# EAGLE schematic DM01x2 (EAGLE 6.6.0)

## Sheet 1 of 6
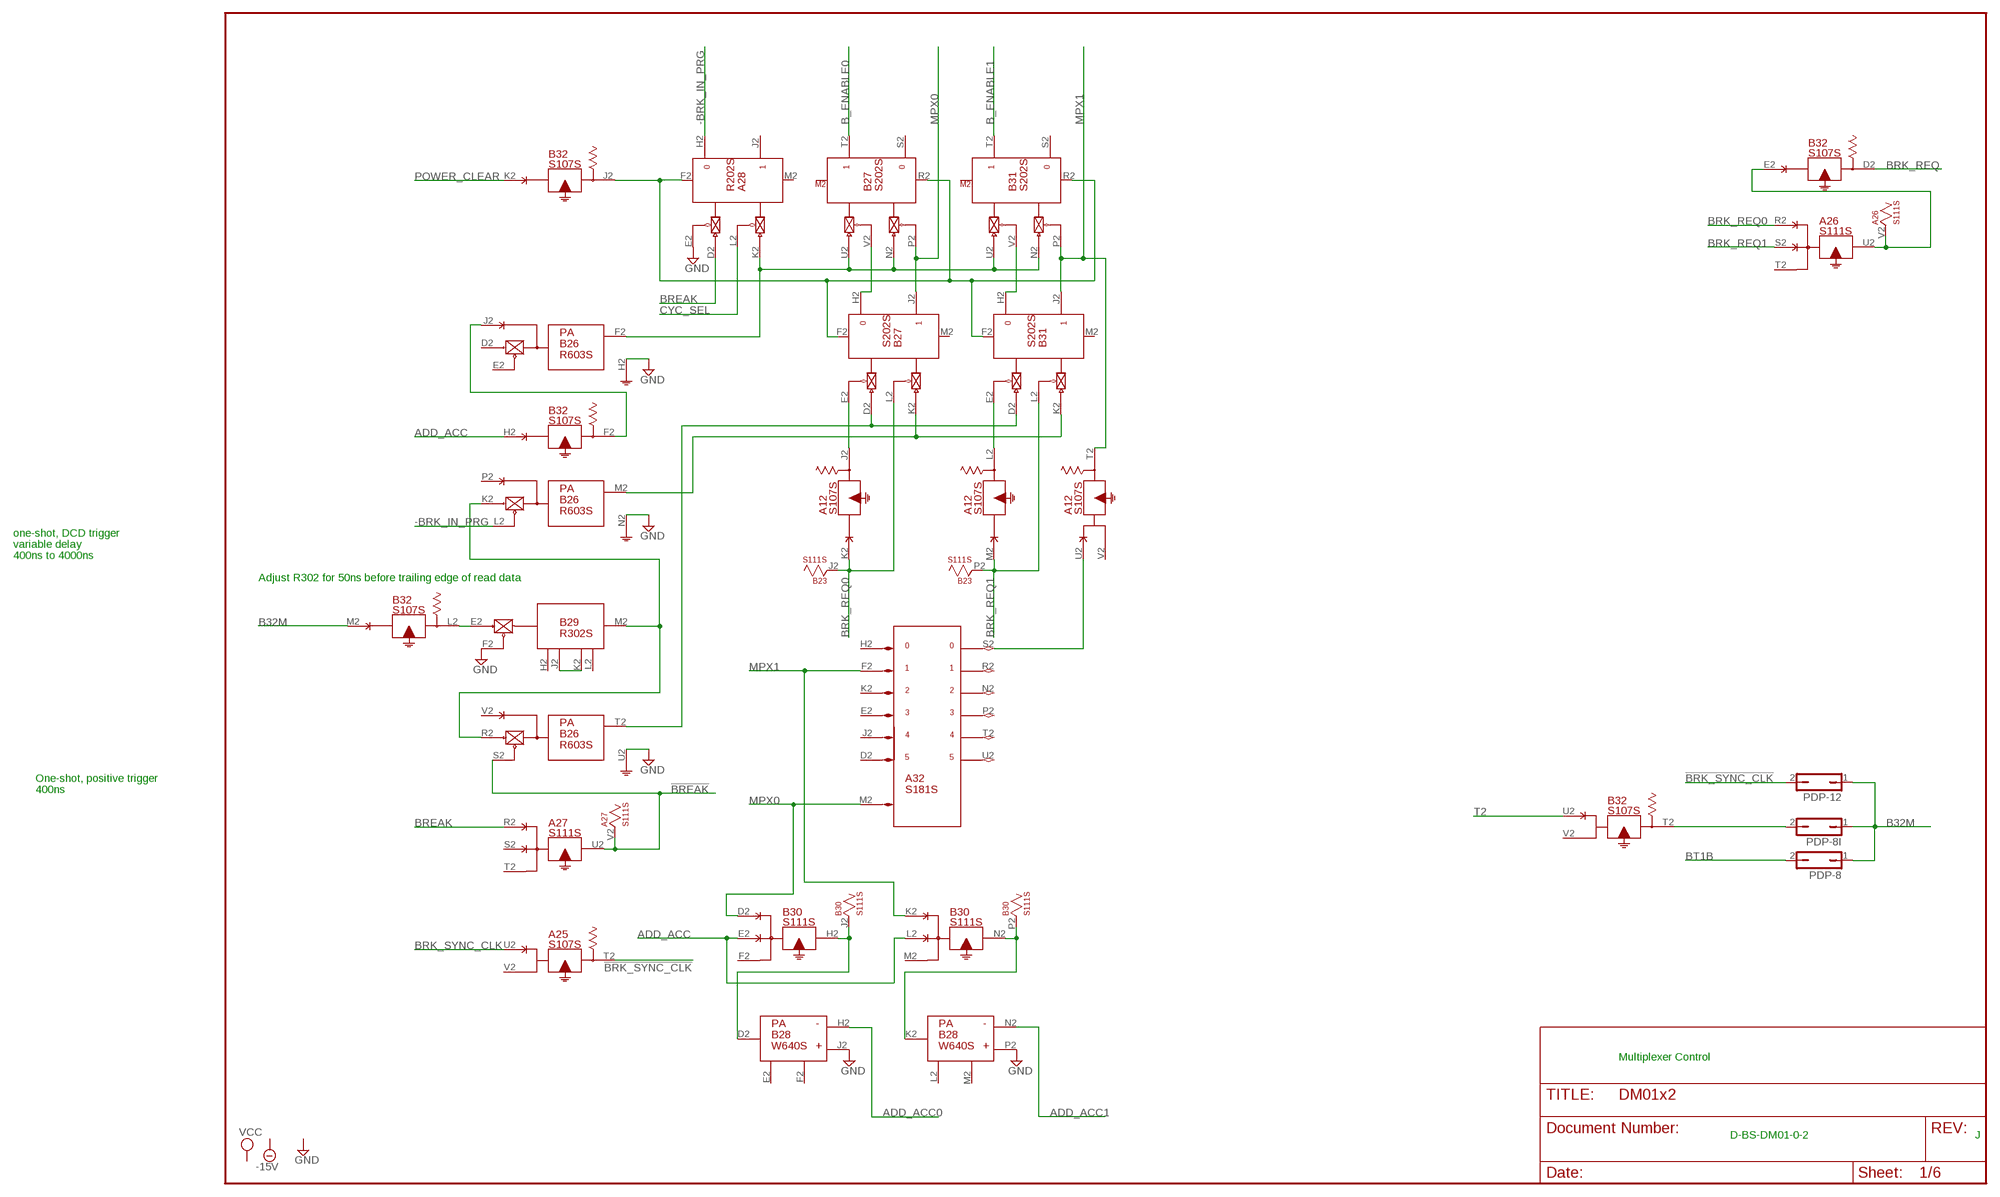
[diagram p0: schematic, sheet 1]

### Parts
A12  S107S  R107S  [H807S]
A25  S107S  R107S  [H807S]
A26  S111S  R111S  [H807S]
A27  S111S  R111S  [H807S]
A28  R202S  [H807S]
A32  S181S  R181S  [H807S]
B23  S111S  R111S  [H807S]
B26  R603S  [H807S]
B27  S202S  R202S  [H807S]
B28  W640S  [H807S]
B29  R302S  [H807S]
B30  S111S  R111S  [H807S]
B31  S202S  R202S  [H807S]
B32  S107S  R107S  [H807S]
PDP-8  JP1Q  [JP1]
PDP-8I  JP1Q  [JP1]
PDP-12  JP1Q  [JP1]

### Nets
!BREAK: A27.U2(U:O$1) A27.V2 B26.S2(T:EN0)
!BRK_SYNC_CLK: A25.T2(T:O$1) PDP-12.2
-BRK_IN_PRG: A28.H2 B26.L2(M:EN0)
ADD_ACC: B30.E2(H:I$2) B30.L2(N:I$2) B32.H2(F:I$1) ; also sheet 2
ADD_ACC0: B28.H2(H) ; also sheet 2
ADD_ACC1: B28.N2(H) ; also sheet 2
B32M: B32.M2(L:I$1) PDP-8.1 PDP-8I.1 PDP-12.1
B_ENABLE0: B27.T2 ; also sheet 2,4
B_ENABLE1: B31.T2 ; also sheet 2,4
BREAK: A27.R2(U:I$1) A28.D2(J:PU0) ; also sheet 2,4
BRK_REQ: B32.D2(D:O$1) ; also sheet 2
BRK_REQ0: A12.K2(J:I$1) A26.R2(U:I$1) B23.J2 B27.L2(J:EN1) ; also sheet 2
BRK_REQ1: A12.M2(L:I$1) A26.S2(U:I$2) B23.P2 B31.L2(J:EN1) ; also sheet 2
BRK_SYNC_CLK: A25.U2(T:I$1) ; also sheet 3
BT1B: PDP-8.2 ; also sheet 3
CYC_SEL: A28.L2(J:EN1) ; also sheet 2,5
GND [Supply]: A28.E2(J:EN0) B26.H2(F:G) B26.N2(M:G) B26.U2(T:G) B28.J2(J) B28.P2(J) B29.F2(M:F) ; also sheet 4
MPX0: A32.M2(M) B27.J2 B27.P2(T:EN0) B30.D2(H:I$1) ; also sheet 2,4
MPX1: A12.T2(T:O$1) A32.F2(F) B30.K2(N:I$1) B31.J2 B31.P2(T:EN0) ; also sheet 2,4
N$2: A28.F2(J:RESET) B27.F2(J:RESET) B27.R2(T:RESET) B31.F2(J:RESET) B31.R2(T:RESET) B32.J2(J:O$1)
N$3: B26.J2(F:I$1) B32.F2(F:O$1)
N$4: B32.T2(T:O$1) PDP-8I.2
N$5: B26.K2(M:PU0) B26.R2(T:PU0) B29.M2(M:M)
N$7: B27.H2 B27.V2(T:EN1)
N$9: B31.H2 B31.V2(T:EN1)
N$10: B26.M2(M:O) B27.K2(J:PU1) B31.K2(J:PU1)
N$12: A28.K2(J:PU1) B26.F2(F:O) B27.N2(T:PU0) B27.U2(T:PU1) B31.N2(T:PU0) B31.U2(T:PU1)
N$21: A26.U2(U:O$1) A26.V2 B32.E2(D:I$1)
N$23: A12.J2(J:O$1) B27.E2(J:EN0)
N$24: A12.L2(L:O$1) B31.E2(J:EN0)
N$30: B28.D2(D) B30.H2(H:O$1) B30.J2
N$32: B26.T2(T:O) B27.D2(J:PU0) B31.D2(J:PU0)
N$36: B28.K2(D) B30.N2(N:O$1) B30.P2
N$38: A12.U2(T:I$1) A32.S2(S)
N$46: B29.E2(M:E) B32.L2(L:O$1)
N$47: B29.J2(M:J) B29.K2(M:K)
POWER_CLEAR: B32.K2(J:I$1) ; also sheet 3
T2: B32.U2(T:I$1) ; also sheet 3
Unconnected: A12.V2(T:I$2) A25.V2(T:I$2) A26.T2(U:I$3) A27.S2(U:I$2) A27.T2(U:I$3) A28.J2 A28.M2(J:SET) A28.N2(T:PU0) A28.P2(T:EN0) A28.R2(T:RESET) A28.S2 A28.T2 A28.U2(T:PU1) A28.V2(T:EN1) A32.D2(D) A32.E2(E) A32.H2(H) A32.J2(J) A32.K2(K) A32.L2(I$1) A32.N2(N) A32.P2(P) A32.R2(R) A32.T2(T) A32.U2(U) A32.V2(O$1) B23.V2 B26.D2(F:PU0) B26.E2(F:EN0) B26.P2(M:I$1) B26.V2(T:I$1) B27.M2(J:SET) B27.S2 B28.E2(E) B28.F2(F) B28.L2(E) B28.M2(F) B29.H2(M:H) B29.L2(M:L) B30.F2(H:I$3) B30.M2(N:I$3) B30.R2(U:I$1) B30.S2(U:I$2) B30.T2(U:I$3) B30.U2(U:O$1) B30.V2 B31.M2(J:SET) B31.S2 B32.V2(T:I$2)

### Notes on the sheet
- one-shot, DCD trigger
- variable delay
- 400ns to 4000ns
- Adjust R302 for 50ns before trailing edge of read data
- One-shot, positive trigger
- 400ns
- Multiplexer Control
- D-BS-DM01-0-2 | J

## Sheet 2 of 6
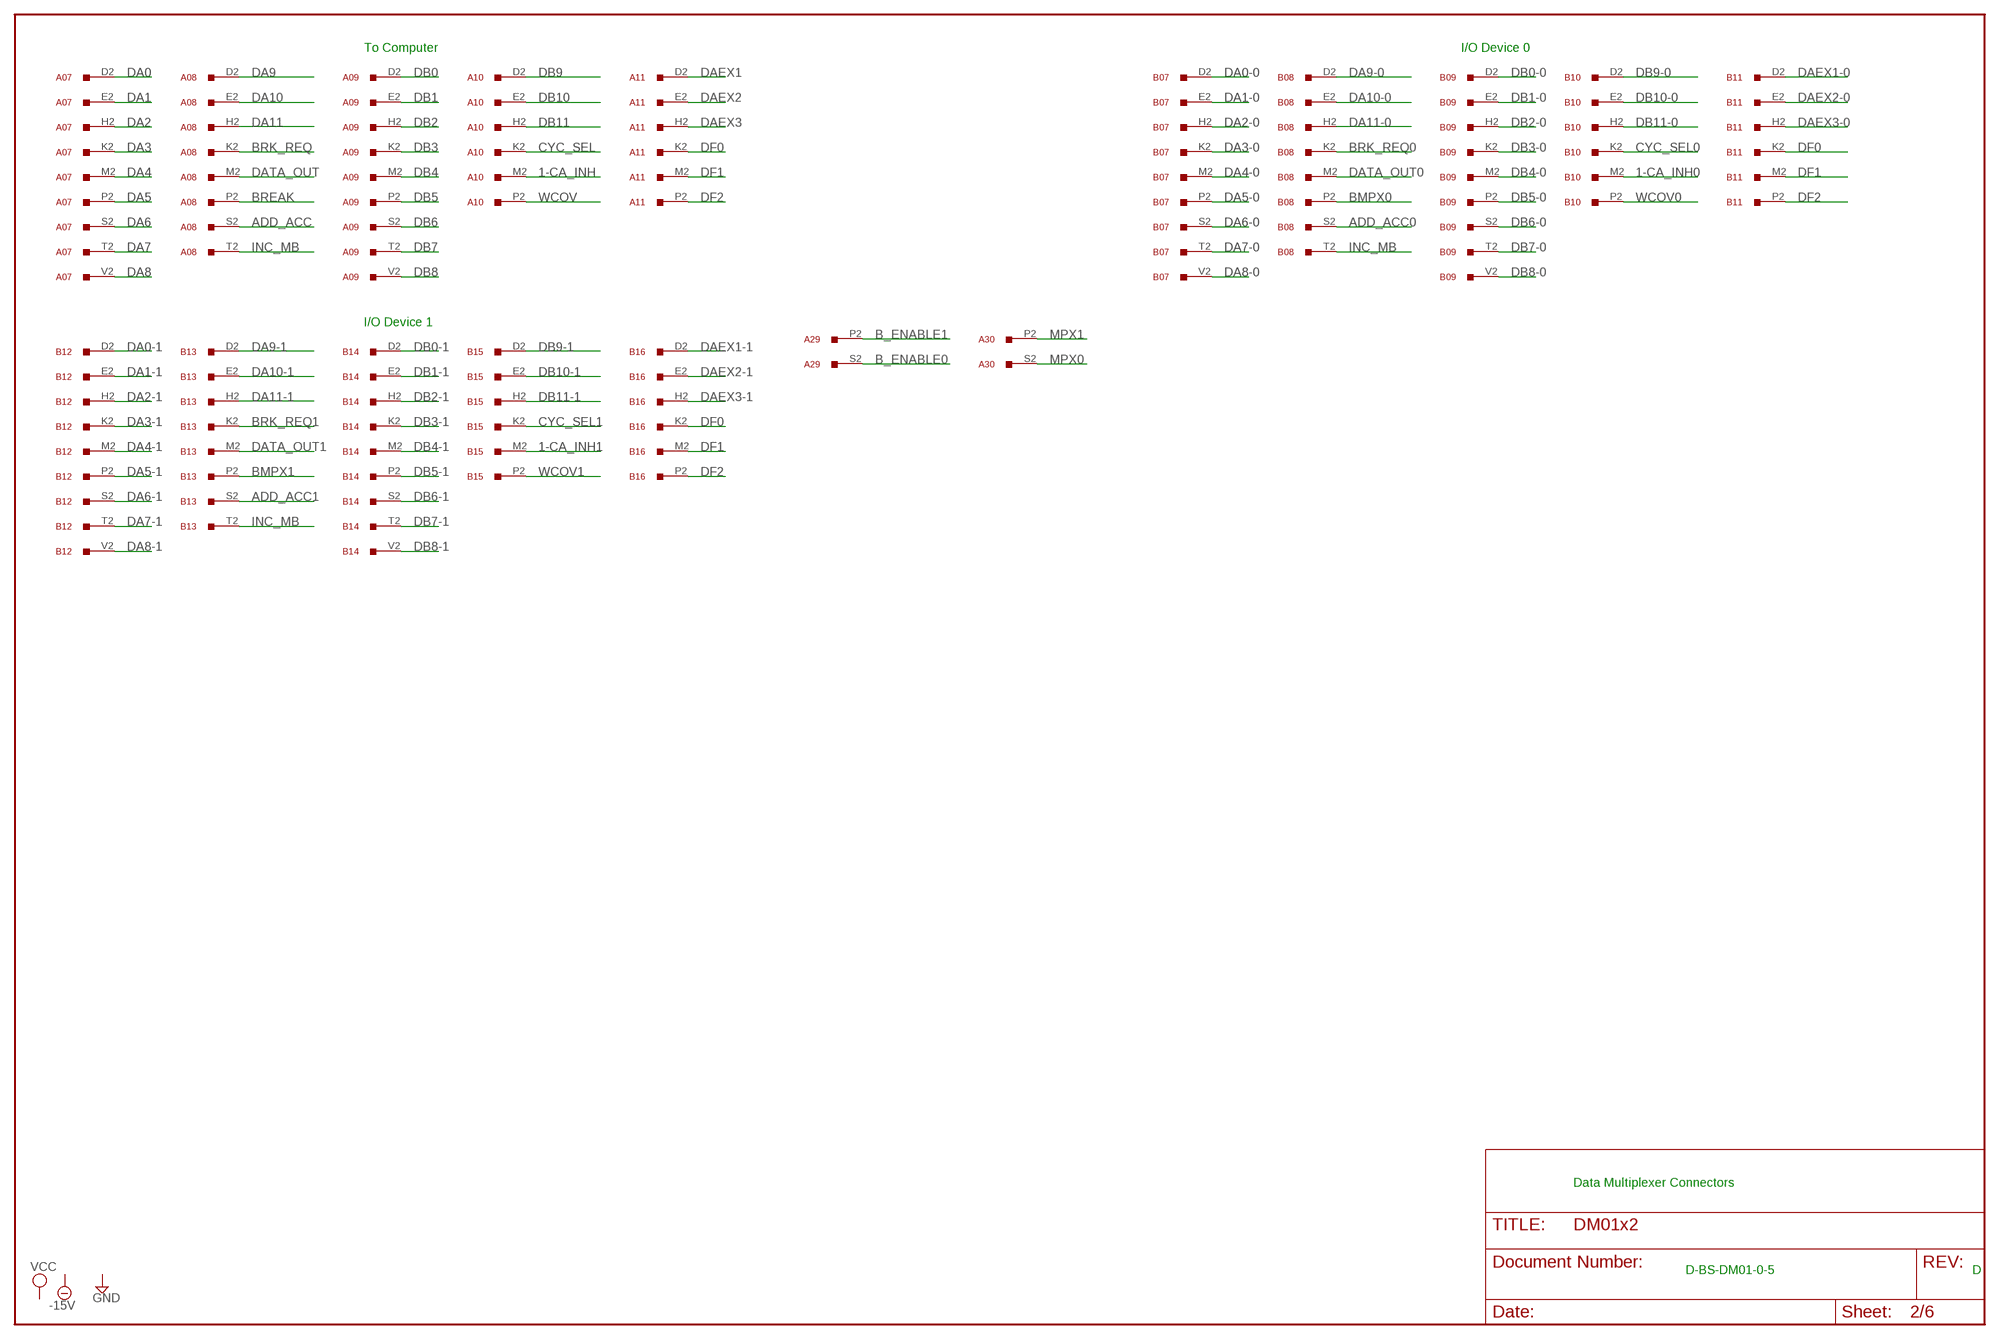
[diagram p1: schematic, sheet 2]

### Parts
A07  W021S  [H807S]
A08  W021S  [H807S]
A09  W021S  [H807S]
A10  W021S  [H807S]
A11  W021S  [H807S]
A29  W021S  [H807S]
A30  W021S  [H807S]
B07  W021S  [H807S]
B08  W021S  [H807S]
B09  W021S  [H807S]
B10  W021S  [H807S]
B11  W021S  [H807S]
B12  W021S  [H807S]
B13  W021S  [H807S]
B14  W021S  [H807S]
B15  W021S  [H807S]
B16  W021S  [H807S]

### Nets
1-CA_INH: A10.M2 ; also sheet 6
1-CA_INH0: B10.M2 ; also sheet 6
1-CA_INH1: B15.M2 ; also sheet 6
ADD_ACC: A08.S2 ; also sheet 1
ADD_ACC0: B08.S2 ; also sheet 1
ADD_ACC1: B13.S2 ; also sheet 1
B_ENABLE0: A29.S2 ; also sheet 1,4
B_ENABLE1: A29.P2 ; also sheet 1,4
BMPX0: B08.P2 ; also sheet 4
BMPX1: B13.P2 ; also sheet 4
BREAK: A08.P2 ; also sheet 1,4
BRK_REQ: A08.K2 ; also sheet 1
BRK_REQ0: B08.K2 ; also sheet 1
BRK_REQ1: B13.K2 ; also sheet 1
CYC_SEL: A10.K2 ; also sheet 1,5
CYC_SEL0: B10.K2 ; also sheet 5
CYC_SEL1: B15.K2 ; also sheet 5
DA0: A07.D2 ; also sheet 5
DA0-0: B07.D2 ; also sheet 5
DA0-1: B12.D2 ; also sheet 5
DA1: A07.E2 ; also sheet 5
DA1-0: B07.E2 ; also sheet 5
DA1-1: B12.E2 ; also sheet 5
DA2: A07.H2 ; also sheet 5
DA2-0: B07.H2 ; also sheet 5
DA2-1: B12.H2 ; also sheet 5
DA3: A07.K2 ; also sheet 5
DA3-0: B07.K2 ; also sheet 5
DA3-1: B12.K2 ; also sheet 5
DA4: A07.M2 ; also sheet 5
DA4-0: B07.M2 ; also sheet 5
DA4-1: B12.M2 ; also sheet 5
DA5: A07.P2 ; also sheet 5
DA5-0: B07.P2 ; also sheet 5
DA5-1: B12.P2 ; also sheet 5
DA6: A07.S2 ; also sheet 5
DA6-0: B07.S2 ; also sheet 5
DA6-1: B12.S2 ; also sheet 5
DA7: A07.T2 ; also sheet 5
DA7-0: B07.T2 ; also sheet 5
DA7-1: B12.T2 ; also sheet 5
DA8: A07.V2 ; also sheet 5
DA8-0: B07.V2 ; also sheet 5
DA8-1: B12.V2 ; also sheet 5
DA9: A08.D2 ; also sheet 5
DA9-0: B08.D2 ; also sheet 5
DA9-1: B13.D2 ; also sheet 5
DA10: A08.E2 ; also sheet 5
DA10-0: B08.E2 ; also sheet 5
DA10-1: B13.E2 ; also sheet 5
DA11: A08.H2 ; also sheet 5
DA11-0: B08.H2 ; also sheet 5
DA11-1: B13.H2 ; also sheet 5
DAEX1: A11.D2 ; also sheet 5
DAEX1-0: B11.D2 ; also sheet 5
DAEX1-1: B16.D2 ; also sheet 5
DAEX2: A11.E2 ; also sheet 5
DAEX2-0: B11.E2 ; also sheet 5
DAEX2-1: B16.E2 ; also sheet 5
DAEX3: A11.H2 ; also sheet 5
DAEX3-0: B11.H2 ; also sheet 5
DAEX3-1: B16.H2 ; also sheet 5
DATA_OUT: A08.M2 ; also sheet 6
DATA_OUT0: B08.M2 ; also sheet 6
DATA_OUT1: B13.M2 ; also sheet 6
DB0: A09.D2 ; also sheet 6
DB0-0: B09.D2 ; also sheet 6
DB0-1: B14.D2 ; also sheet 6
DB1: A09.E2 ; also sheet 6
DB1-0: B09.E2 ; also sheet 6
DB1-1: B14.E2 ; also sheet 6
DB2: A09.H2 ; also sheet 6
DB2-0: B09.H2 ; also sheet 6
DB2-1: B14.H2 ; also sheet 6
DB3: A09.K2 ; also sheet 6
DB3-0: B09.K2 ; also sheet 6
DB3-1: B14.K2 ; also sheet 6
DB4: A09.M2 ; also sheet 6
DB4-0: B09.M2 ; also sheet 6
DB4-1: B14.M2 ; also sheet 6
DB5: A09.P2 ; also sheet 6
DB5-0: B09.P2 ; also sheet 6
DB5-1: B14.P2 ; also sheet 6
DB6: A09.S2 ; also sheet 6
DB6-0: B09.S2 ; also sheet 6
DB6-1: B14.S2 ; also sheet 6
DB7: A09.T2 ; also sheet 6
DB7-0: B09.T2 ; also sheet 6
DB7-1: B14.T2 ; also sheet 6
DB8: A09.V2 ; also sheet 6
DB8-0: B09.V2 ; also sheet 6
DB8-1: B14.V2 ; also sheet 6
DB9: A10.D2 ; also sheet 6
DB9-0: B10.D2 ; also sheet 6
DB9-1: B15.D2 ; also sheet 6
DB10: A10.E2 ; also sheet 6
DB10-0: B10.E2 ; also sheet 6
DB10-1: B15.E2 ; also sheet 6
DB11: A10.H2 ; also sheet 6
DB11-0: B10.H2 ; also sheet 6
DB11-1: B15.H2 ; also sheet 6
DF0: A11.K2 B11.K2 B16.K2
DF1: A11.M2 B11.M2 B16.M2
DF2: A11.P2 B11.P2 B16.P2
INC_MB: A08.T2 B08.T2 B13.T2
MPX0: A30.S2 ; also sheet 1,4
MPX1: A30.P2 ; also sheet 1,4
WCOV: A10.P2 ; also sheet 4
WCOV0: B10.P2 ; also sheet 4
WCOV1: B15.P2 ; also sheet 4
Unconnected: A08.V2 A10.S2 A10.T2 A10.V2 A11.S2 A11.T2 A11.V2 A29.D2 A29.E2 A29.H2 A29.K2 A29.M2 A29.T2 A29.V2 A30.D2 A30.E2 A30.H2 A30.K2 A30.M2 A30.T2 A30.V2 B08.V2 B10.S2 B10.T2 B10.V2 B11.S2 B11.T2 B11.V2 B13.V2 B15.S2 B15.T2 B15.V2 B16.S2 B16.T2 B16.V2

### Notes on the sheet
- To Computer | I/O Device 0
- I/O Device 1
- Data Multiplexer Connectors
- D-BS-DM01-0-5 | D

## Sheet 3 of 6
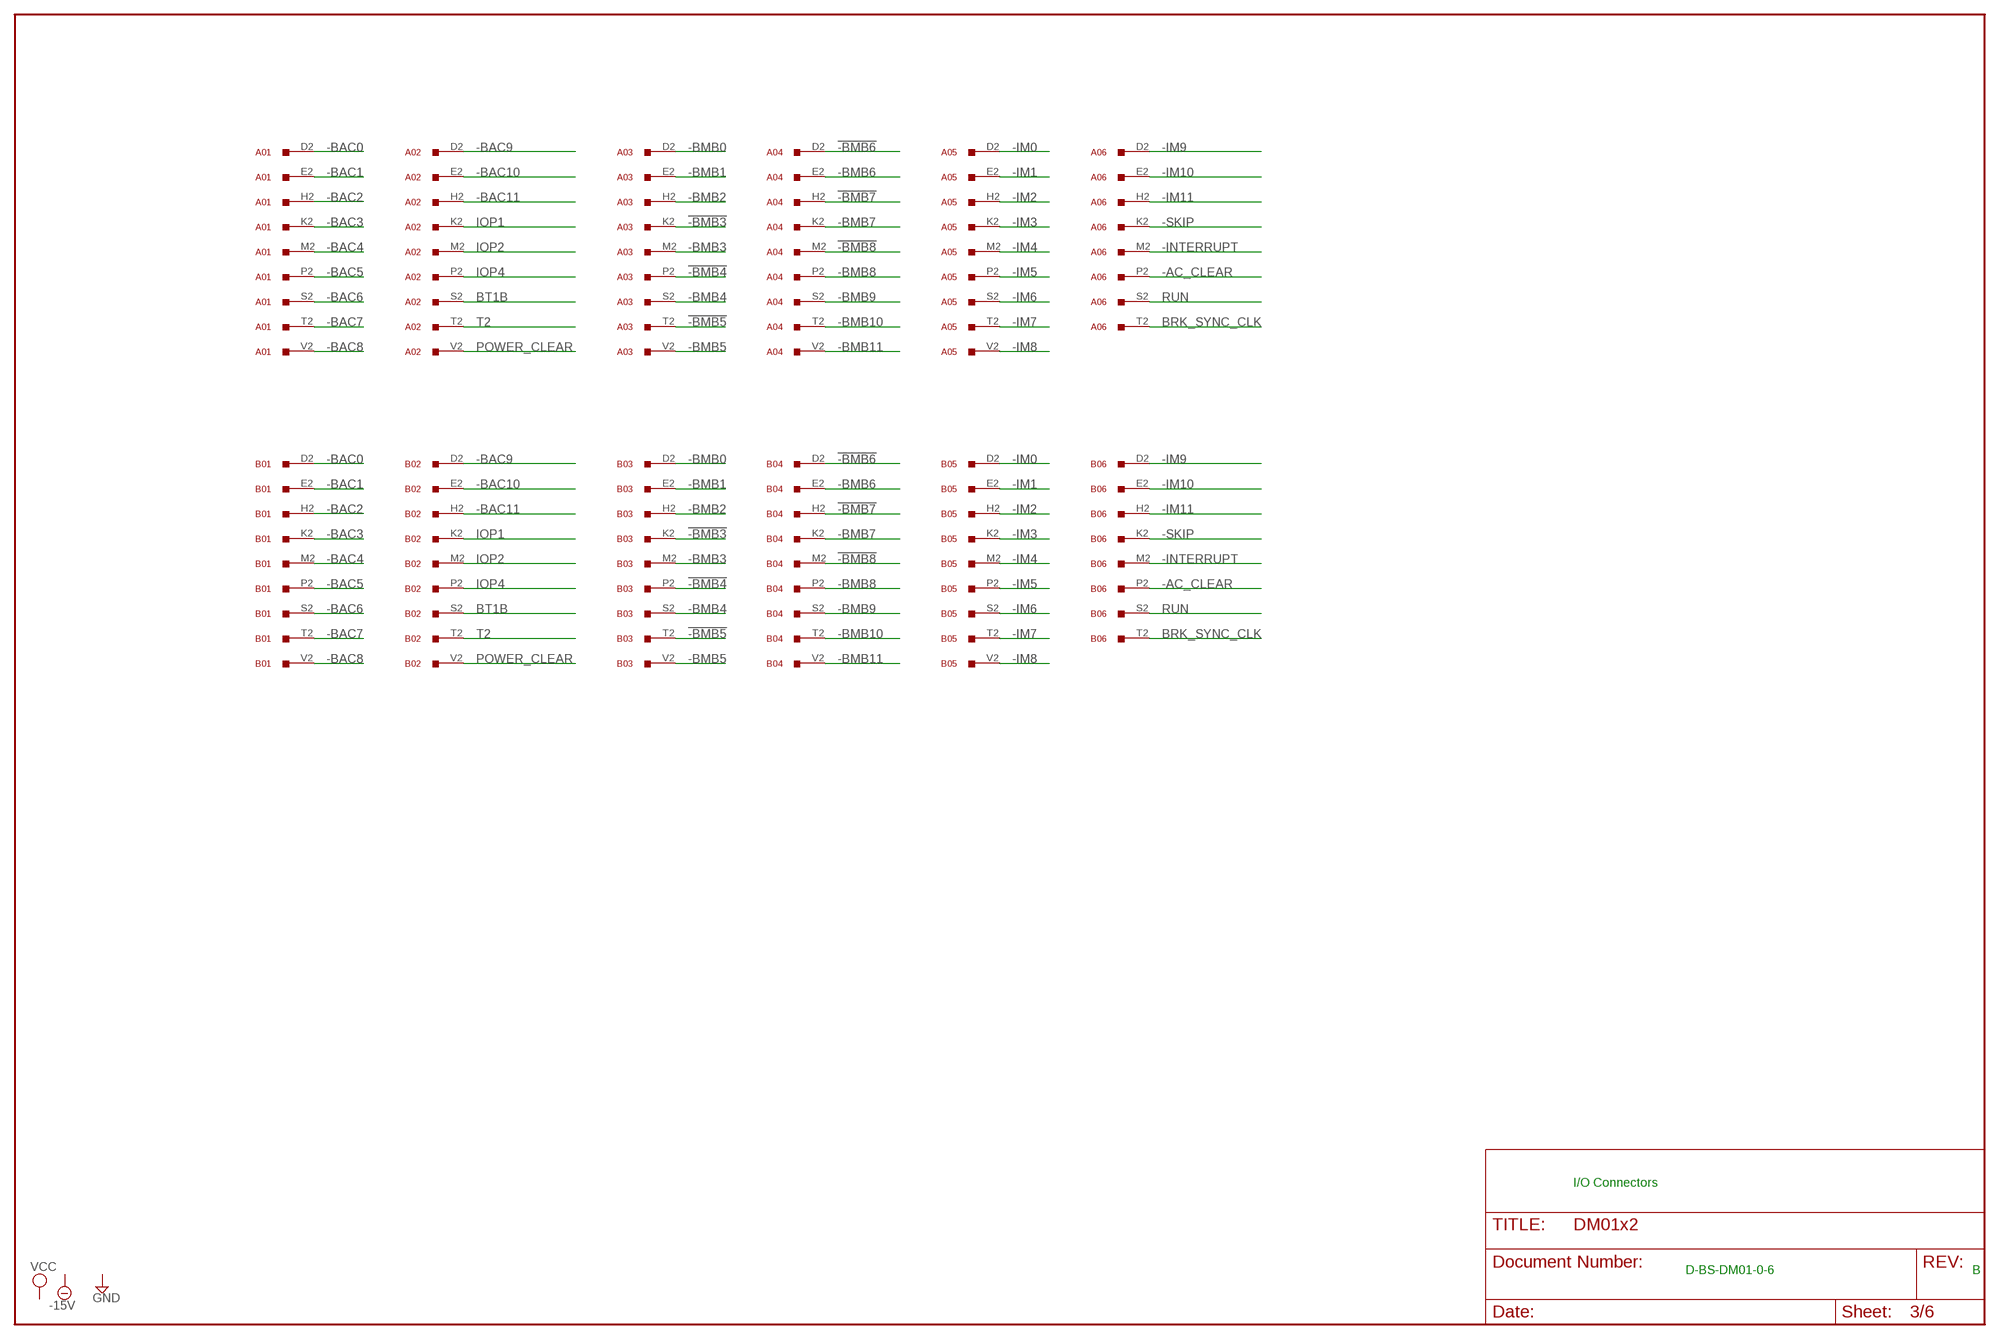
[diagram p2: schematic, sheet 3]

### Parts
A01  W021S  [H807S]
A02  W021S  [H807S]
A03  W021S  [H807S]
A04  W021S  [H807S]
A05  W021S  [H807S]
A06  W021S  [H807S]
B01  W021S  [H807S]
B02  W021S  [H807S]
B03  W021S  [H807S]
B04  W021S  [H807S]
B05  W021S  [H807S]
B06  W021S  [H807S]

### Nets
!-BMB3: A03.K2 B03.K2
!-BMB4: A03.P2 B03.P2
!-BMB5: A03.T2 B03.T2
!-BMB6: A04.D2 B04.D2
!-BMB7: A04.H2 B04.H2
!-BMB8: A04.M2 B04.M2
-AC_CLEAR: A06.P2 B06.P2
-BAC0: A01.D2 B01.D2
-BAC1: A01.E2 B01.E2
-BAC2: A01.H2 B01.H2
-BAC3: A01.K2 B01.K2
-BAC4: A01.M2 B01.M2
-BAC5: A01.P2 B01.P2
-BAC6: A01.S2 B01.S2
-BAC7: A01.T2 B01.T2
-BAC8: A01.V2 B01.V2
-BAC9: A02.D2 B02.D2
-BAC10: A02.E2 B02.E2
-BAC11: A02.H2 B02.H2
-BMB0: A03.D2 B03.D2
-BMB1: A03.E2 B03.E2
-BMB2: A03.H2 B03.H2
-BMB3: A03.M2 B03.M2
-BMB4: A03.S2 B03.S2
-BMB5: A03.V2 B03.V2
-BMB6: A04.E2 B04.E2
-BMB7: A04.K2 B04.K2
-BMB8: A04.P2 B04.P2
-BMB9: A04.S2 B04.S2
-BMB10: A04.T2 B04.T2
-BMB11: A04.V2 B04.V2
-IM0: A05.D2 B05.D2
-IM1: A05.E2 B05.E2
-IM2: A05.H2 B05.H2
-IM3: A05.K2 B05.K2
-IM4: A05.M2 B05.M2
-IM5: A05.P2 B05.P2
-IM6: A05.S2 B05.S2
-IM7: A05.T2 B05.T2
-IM8: A05.V2 B05.V2
-IM9: A06.D2 B06.D2
-IM10: A06.E2 B06.E2
-IM11: A06.H2 B06.H2
-INTERRUPT: A06.M2 B06.M2
-SKIP: A06.K2 B06.K2
BRK_SYNC_CLK: A06.T2 B06.T2 ; also sheet 1
BT1B: A02.S2 B02.S2 ; also sheet 1
IOP1: A02.K2 B02.K2
IOP2: A02.M2 B02.M2
IOP4: A02.P2 B02.P2
POWER_CLEAR: A02.V2 B02.V2 ; also sheet 1
RUN: A06.S2 B06.S2
T2: A02.T2 B02.T2 ; also sheet 1
Unconnected: A06.V2 B06.V2

### Notes on the sheet
- I/O Connectors
- D-BS-DM01-0-6 | B

## Sheet 4 of 6
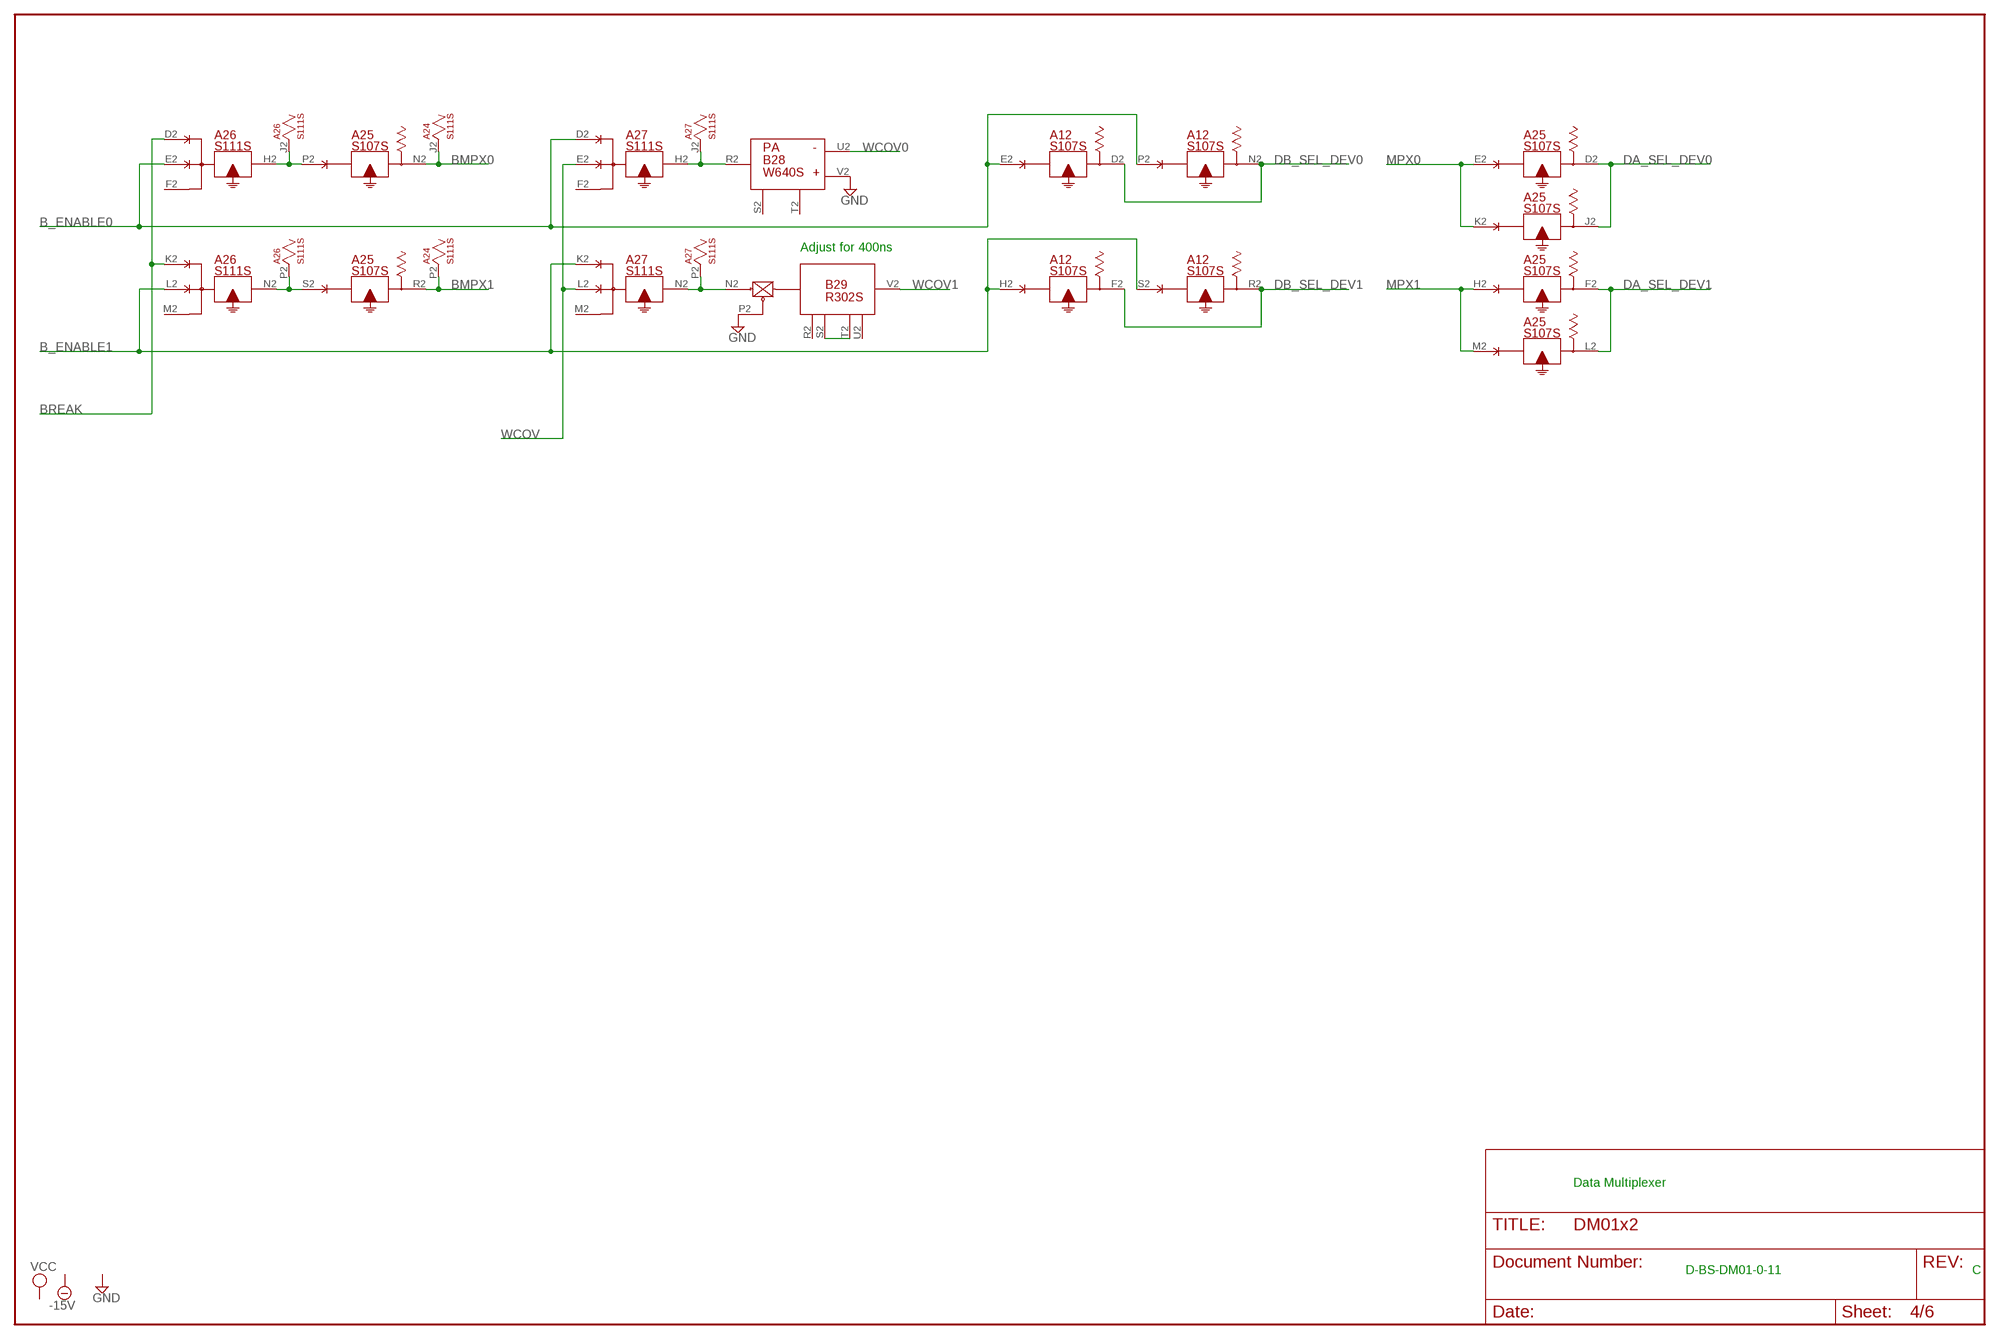
[diagram p3: schematic, sheet 4]

### Parts
A24  S111S  R111S  [H807S]

### Nets
B_ENABLE0: A12.E2(D:I$1) A12.P2(N:I$1) A26.E2(H:I$2) A27.D2(H:I$1) ; also sheet 1,2
B_ENABLE1: A12.H2(F:I$1) A12.S2(R:I$1) A26.L2(N:I$2) A27.K2(N:I$1) ; also sheet 1,2
BMPX0: A24.J2 A25.N2(N:O$1) ; also sheet 2
BMPX1: A24.P2 A25.R2(R:O$1) ; also sheet 2
BREAK: A26.D2(H:I$1) A26.K2(N:I$1) ; also sheet 1,2
DA_SEL_DEV0: A25.D2(D:O$1) A25.J2(J:O$1) ; also sheet 5
DA_SEL_DEV1: A25.F2(F:O$1) A25.L2(L:O$1) ; also sheet 5
DB_SEL_DEV0: A12.D2(D:O$1) A12.N2(N:O$1) ; also sheet 6
DB_SEL_DEV1: A12.F2(F:O$1) A12.R2(R:O$1) ; also sheet 6
GND [Supply]: B28.V2(J) B29.P2(V:F) ; also sheet 1
MPX0: A25.E2(D:I$1) A25.K2(J:I$1) ; also sheet 1,2
MPX1: A25.H2(F:I$1) A25.M2(L:I$1) ; also sheet 1,2
N$49: A27.H2(H:O$1) A27.J2 B28.R2(D)
N$50: A27.N2(N:O$1) A27.P2 B29.N2(V:E)
N$51: B29.S2(V:J) B29.T2(V:K)
N$64: A25.P2(N:I$1) A26.H2(H:O$1) A26.J2
N$65: A25.S2(R:I$1) A26.N2(N:O$1) A26.P2
WCOV: A27.E2(H:I$2) A27.L2(N:I$2) ; also sheet 2
WCOV0: B28.U2(H) ; also sheet 2
WCOV1: B29.V2(V:M) ; also sheet 2
Unconnected: A24.V2 A26.F2(H:I$3) A26.M2(N:I$3) A27.F2(H:I$3) A27.M2(N:I$3) B28.S2(E) B28.T2(F) B29.R2(V:H) B29.U2(V:L)

### Notes on the sheet
- Adjust for 400ns
- Data Multiplexer
- D-BS-DM01-0-11 | C

## Sheet 5 of 6
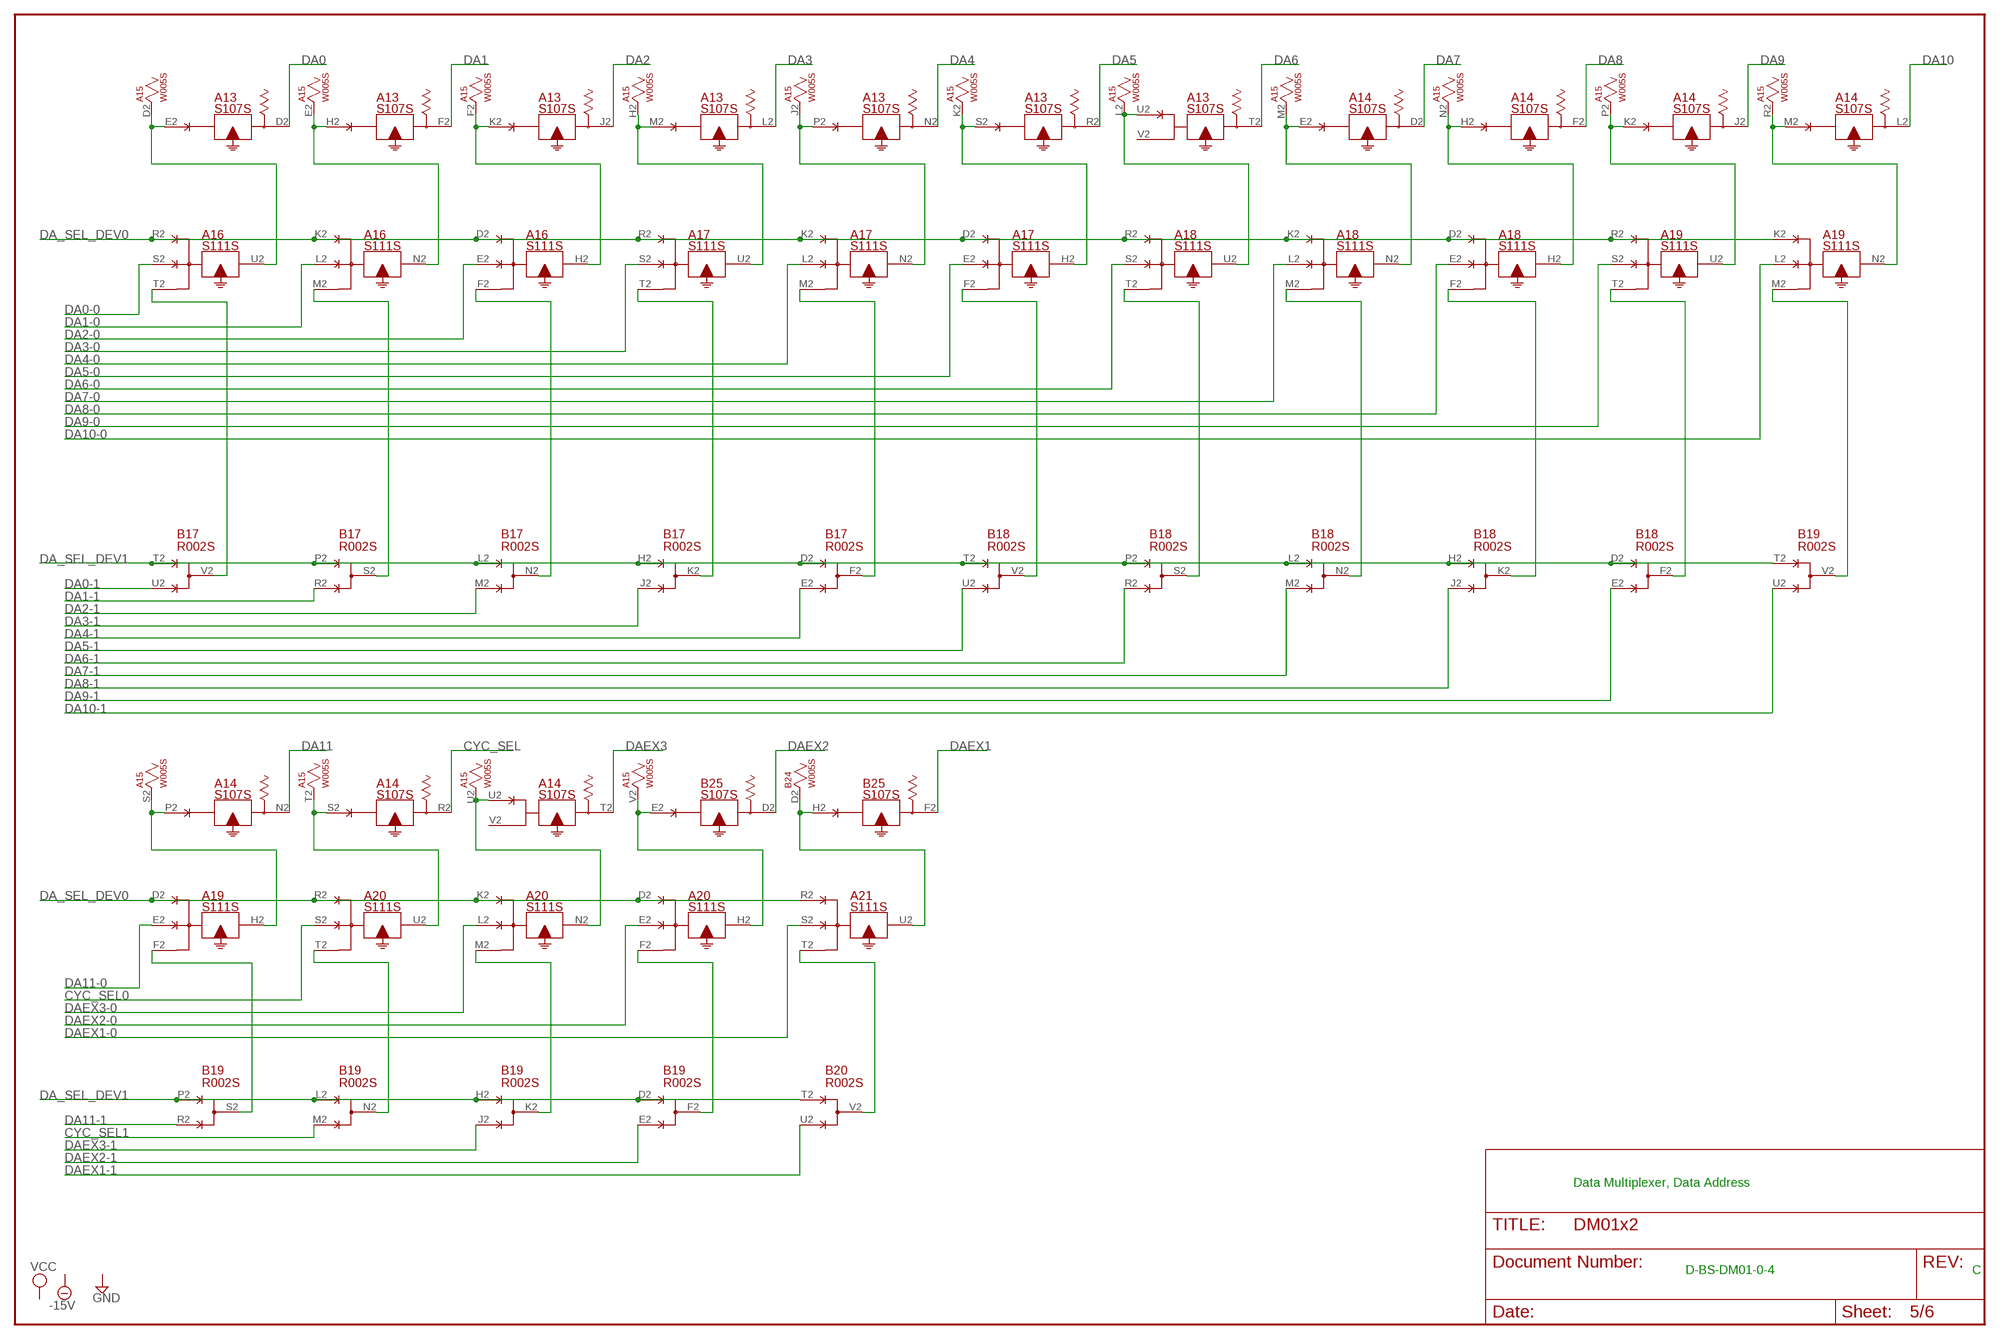
[diagram p4: schematic, sheet 5]

### Parts
A13  S107S  R107S  [H807S]
A14  S107S  R107S  [H807S]
A15  W005S  [H807S]
A16  S111S  R111S  [H807S]
A17  S111S  R111S  [H807S]
A18  S111S  R111S  [H807S]
A19  S111S  R111S  [H807S]
A20  S111S  R111S  [H807S]
A21  S111S  R111S  [H807S]
B17  R002S  [H807S]
B18  R002S  [H807S]
B19  R002S  [H807S]
B20  R002S  [H807S]
B24  W005S  [H807S]
B25  S107S  R107S  [H807S]

### Nets
CYC_SEL: A14.R2(R:O$1) ; also sheet 1,2
CYC_SEL0: A20.S2(U:I$2) ; also sheet 2
CYC_SEL1: B19.M2(N:E) ; also sheet 2
DA0: A13.D2(D:O$1) ; also sheet 2
DA0-0: A16.S2(U:I$2) ; also sheet 2
DA0-1: B17.U2(V:E) ; also sheet 2
DA1: A13.F2(F:O$1) ; also sheet 2
DA1-0: A16.L2(N:I$2) ; also sheet 2
DA1-1: B17.R2(S:E) ; also sheet 2
DA2: A13.J2(J:O$1) ; also sheet 2
DA2-0: A16.E2(H:I$2) ; also sheet 2
DA2-1: B17.M2(N:E) ; also sheet 2
DA3: A13.L2(L:O$1) ; also sheet 2
DA3-0: A17.S2(U:I$2) ; also sheet 2
DA3-1: B17.J2(K:E) ; also sheet 2
DA4: A13.N2(N:O$1) ; also sheet 2
DA4-0: A17.L2(N:I$2) ; also sheet 2
DA4-1: B17.E2(F:E) ; also sheet 2
DA5: A13.R2(R:O$1) ; also sheet 2
DA5-0: A17.E2(H:I$2) ; also sheet 2
DA5-1: B18.U2(V:E) ; also sheet 2
DA6: A13.T2(T:O$1) ; also sheet 2
DA6-0: A18.S2(U:I$2) ; also sheet 2
DA6-1: B18.R2(S:E) ; also sheet 2
DA7: A14.D2(D:O$1) ; also sheet 2
DA7-0: A18.L2(N:I$2) ; also sheet 2
DA7-1: B18.M2(N:E) ; also sheet 2
DA8: A14.F2(F:O$1) ; also sheet 2
DA8-0: A18.E2(H:I$2) ; also sheet 2
DA8-1: B18.J2(K:E) ; also sheet 2
DA9: A14.J2(J:O$1) ; also sheet 2
DA9-0: A19.S2(U:I$2) ; also sheet 2
DA9-1: B18.E2(F:E) ; also sheet 2
DA10: A14.L2(L:O$1) ; also sheet 2
DA10-0: A19.L2(N:I$2) ; also sheet 2
DA10-1: B19.U2(V:E) ; also sheet 2
DA11: A14.N2(N:O$1) ; also sheet 2
DA11-0: A19.E2(H:I$2) ; also sheet 2
DA11-1: B19.R2(S:E) ; also sheet 2
DA_SEL_DEV0: A16.D2(H:I$1) A16.K2(N:I$1) A16.R2(U:I$1) A17.D2(H:I$1) A17.K2(N:I$1) A17.R2(U:I$1) A18.D2(H:I$1) A18.K2(N:I$1) A18.R2(U:I$1) A19.D2(H:I$1) A19.K2(N:I$1) A19.R2(U:I$1) A20.D2(H:I$1) A20.K2(N:I$1) A20.R2(U:I$1) A21.R2(U:I$1) ; also sheet 4
DA_SEL_DEV1: B17.D2(F:D) B17.H2(K:D) B17.L2(N:D) B17.P2(S:D) B17.T2(V:D) B18.D2(F:D) B18.H2(K:D) B18.L2(N:D) B18.P2(S:D) B18.T2(V:D) B19.D2(F:D) B19.H2(K:D) B19.L2(N:D) B19.P2(S:D) B19.T2(V:D) B20.T2(V:D) ; also sheet 4
DAEX1: B25.F2(F:O$1) ; also sheet 2
DAEX1-0: A21.S2(U:I$2) ; also sheet 2
DAEX1-1: B20.U2(V:E) ; also sheet 2
DAEX2: B25.D2(D:O$1) ; also sheet 2
DAEX2-0: A20.E2(H:I$2) ; also sheet 2
DAEX2-1: B19.E2(F:E) ; also sheet 2
DAEX3: A14.T2(T:O$1) ; also sheet 2
DAEX3-0: A20.L2(N:I$2) ; also sheet 2
DAEX3-1: B19.J2(K:E) ; also sheet 2
N$19: A19.F2(H:I$3) B19.S2(S:F)
N$27: A20.T2(U:I$3) B19.N2(N:F)
N$28: A20.M2(N:I$3) B19.K2(K:F)
N$29: A20.F2(H:I$3) B19.F2(F:F)
N$31: A21.T2(U:I$3) B20.V2(V:F)
N$33: A16.T2(U:I$3) B17.V2(V:F)
N$34: A19.M2(N:I$3) B19.V2(V:F)
N$35: A19.T2(U:I$3) B18.F2(F:F)
N$37: A18.F2(H:I$3) B18.K2(K:F)
N$39: A18.M2(N:I$3) B18.N2(N:F)
N$40: A18.T2(U:I$3) B18.S2(S:F)
N$41: A17.F2(H:I$3) B18.V2(V:F)
N$42: A17.M2(N:I$3) B17.F2(F:F)
N$43: A17.T2(U:I$3) B17.K2(K:F)
N$44: A16.F2(H:I$3) B17.N2(N:F)
N$45: A16.M2(N:I$3) B17.S2(S:F)
N$56: A13.E2(D:I$1) A15.D2 A16.U2(U:O$1)
N$57: A13.U2(T:I$1) A15.L2 A18.U2(U:O$1)
N$58: A13.H2(F:I$1) A15.E2 A16.N2(N:O$1)
N$59: A13.K2(J:I$1) A15.F2 A16.H2(H:O$1)
N$60: A13.M2(L:I$1) A15.H2 A17.U2(U:O$1)
N$61: A13.P2(N:I$1) A15.J2 A17.N2(N:O$1)
N$62: A13.S2(R:I$1) A15.K2 A17.H2(H:O$1)
N$63: A14.E2(D:I$1) A15.M2 A18.N2(N:O$1)
N$71: A14.H2(F:I$1) A15.N2 A18.H2(H:O$1)
N$72: A14.K2(J:I$1) A15.P2 A19.U2(U:O$1)
N$73: A14.M2(L:I$1) A15.R2 A19.N2(N:O$1)
N$74: A14.P2(N:I$1) A15.S2 A19.H2(H:O$1)
N$75: A14.S2(R:I$1) A15.T2 A20.U2(U:O$1)
N$76: A14.U2(T:I$1) A15.U2 A20.N2(N:O$1)
N$77: A15.V2 A20.H2(H:O$1) B25.E2(D:I$1)
N$78: A21.U2(U:O$1) B24.D2 B25.H2(F:I$1)
Unconnected: A13.V2(T:I$2) A14.V2(T:I$2) A16.J2 A16.P2 A16.V2 A17.J2 A17.P2 A17.V2 A18.J2 A18.P2 A18.V2 A19.J2 A19.P2 A19.V2 A20.J2 A20.P2 A20.V2 A21.J2 A21.P2 A21.V2

### Notes on the sheet
- Data Multiplexer, Data Address
- D-BS-DM01-0-4 | C

## Sheet 6 of 6
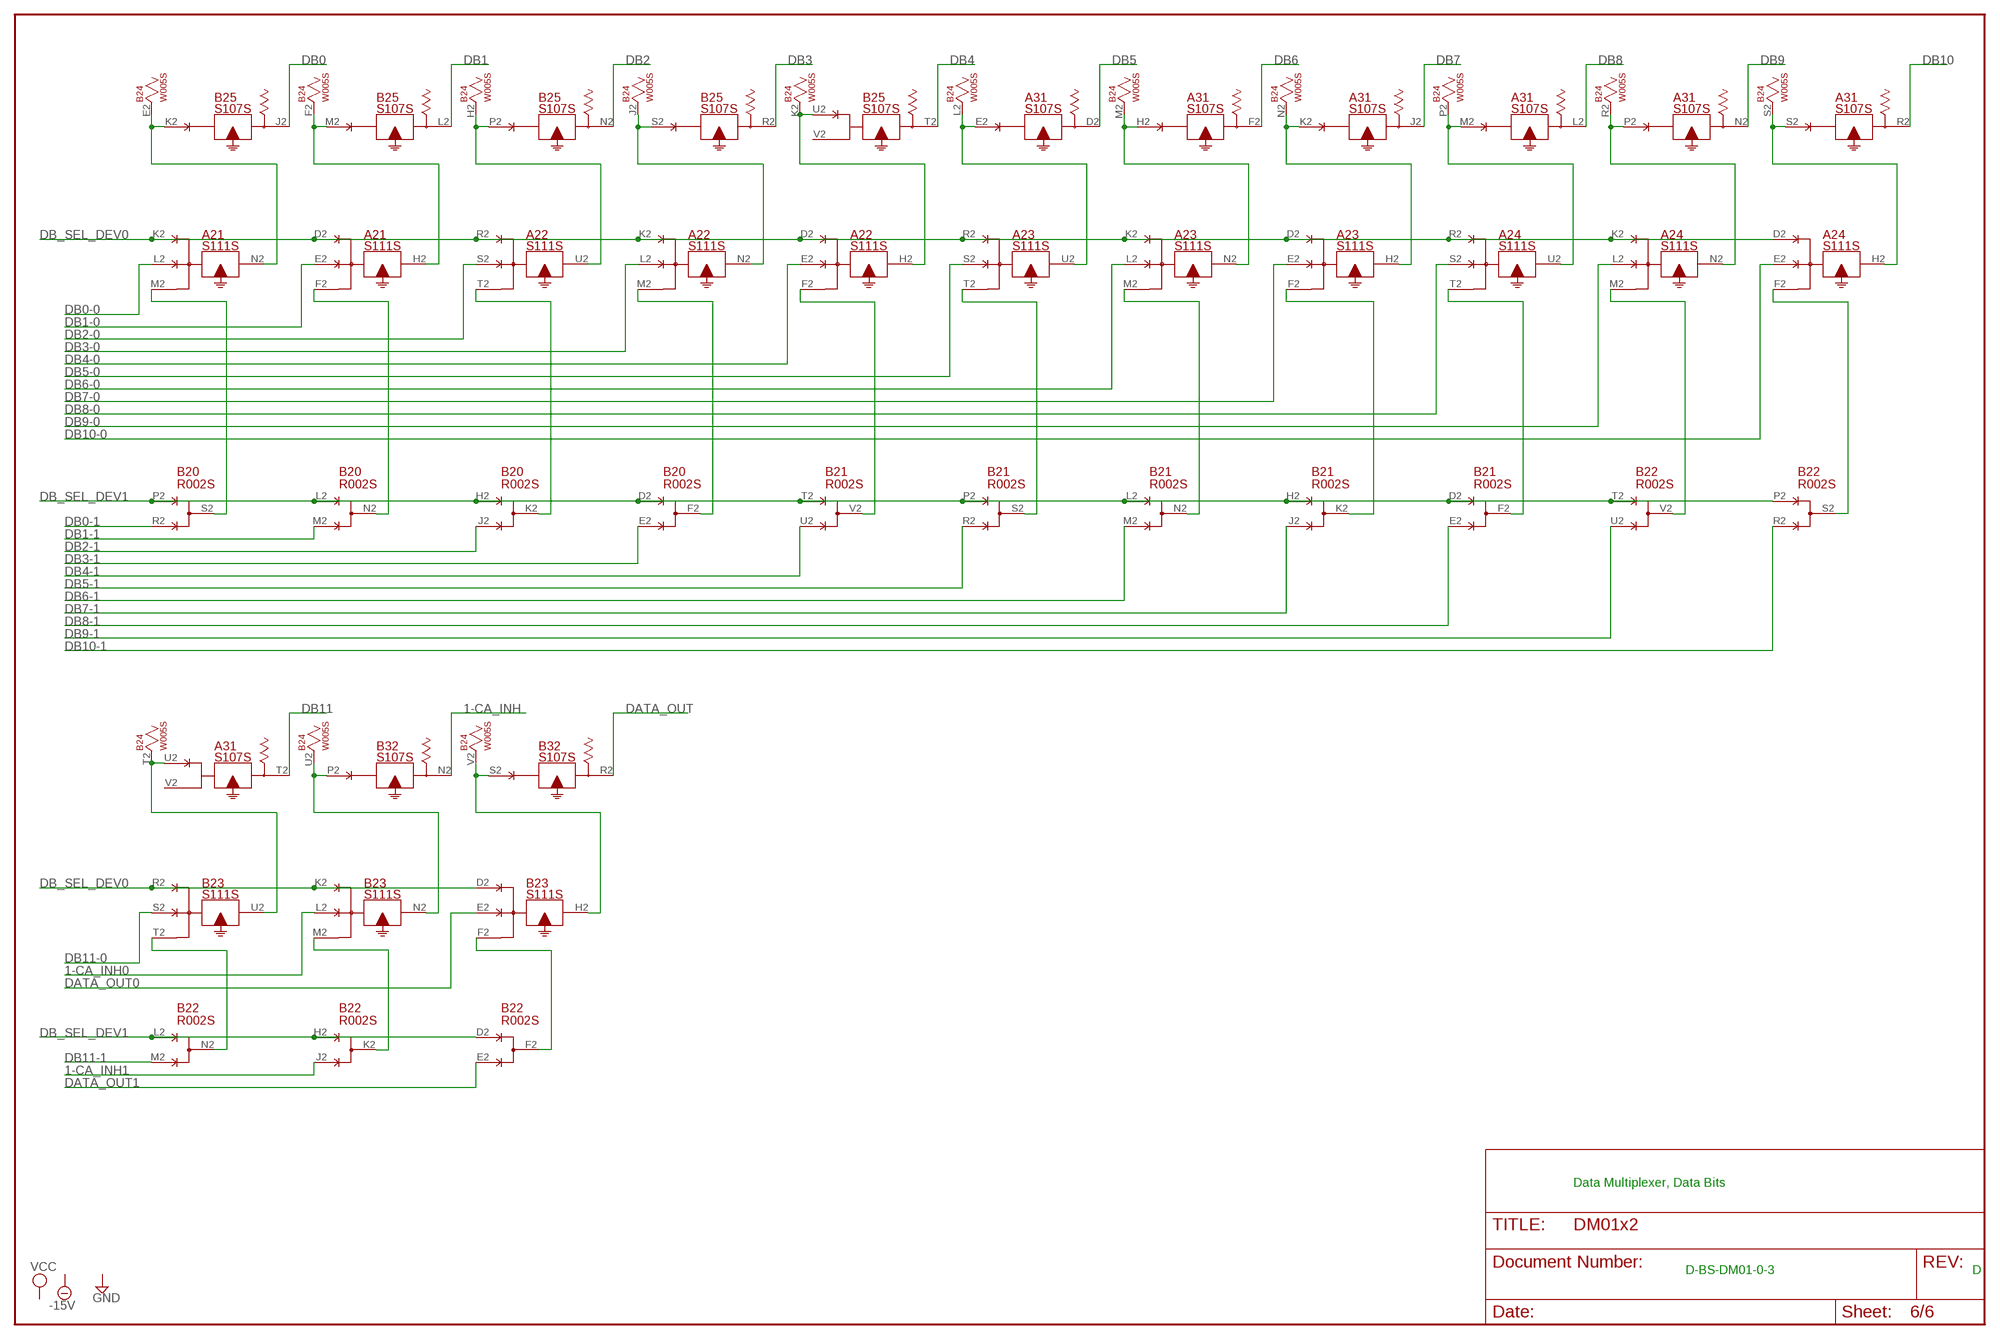
[diagram p5: schematic, sheet 6]

### Parts
A22  S111S  R111S  [H807S]
A23  S111S  R111S  [H807S]
A31  S107S  R107S  [H807S]
B21  R002S  [H807S]
B22  R002S  [H807S]

### Nets
1-CA_INH: B32.N2(N:O$1) ; also sheet 2
1-CA_INH0: B23.L2(N:I$2) ; also sheet 2
1-CA_INH1: B22.J2(K:E) ; also sheet 2
DATA_OUT: B32.R2(R:O$1) ; also sheet 2
DATA_OUT0: B23.E2(H:I$2) ; also sheet 2
DATA_OUT1: B22.E2(F:E) ; also sheet 2
DB0: B25.J2(J:O$1) ; also sheet 2
DB0-0: A21.L2(N:I$2) ; also sheet 2
DB0-1: B20.R2(S:E) ; also sheet 2
DB1: B25.L2(L:O$1) ; also sheet 2
DB1-0: A21.E2(H:I$2) ; also sheet 2
DB1-1: B20.M2(N:E) ; also sheet 2
DB2: B25.N2(N:O$1) ; also sheet 2
DB2-0: A22.S2(U:I$2) ; also sheet 2
DB2-1: B20.J2(K:E) ; also sheet 2
DB3: B25.R2(R:O$1) ; also sheet 2
DB3-0: A22.L2(N:I$2) ; also sheet 2
DB3-1: B20.E2(F:E) ; also sheet 2
DB4: B25.T2(T:O$1) ; also sheet 2
DB4-0: A22.E2(H:I$2) ; also sheet 2
DB4-1: B21.U2(V:E) ; also sheet 2
DB5: A31.D2(D:O$1) ; also sheet 2
DB5-0: A23.S2(U:I$2) ; also sheet 2
DB5-1: B21.R2(S:E) ; also sheet 2
DB6: A31.F2(F:O$1) ; also sheet 2
DB6-0: A23.L2(N:I$2) ; also sheet 2
DB6-1: B21.M2(N:E) ; also sheet 2
DB7: A31.J2(J:O$1) ; also sheet 2
DB7-0: A23.E2(H:I$2) ; also sheet 2
DB7-1: B21.J2(K:E) ; also sheet 2
DB8: A31.L2(L:O$1) ; also sheet 2
DB8-0: A24.S2(U:I$2) ; also sheet 2
DB8-1: B21.E2(F:E) ; also sheet 2
DB9: A31.N2(N:O$1) ; also sheet 2
DB9-0: A24.L2(N:I$2) ; also sheet 2
DB9-1: B22.U2(V:E) ; also sheet 2
DB10: A31.R2(R:O$1) ; also sheet 2
DB10-0: A24.E2(H:I$2) ; also sheet 2
DB10-1: B22.R2(S:E) ; also sheet 2
DB11: A31.T2(T:O$1) ; also sheet 2
DB11-0: B23.S2(U:I$2) ; also sheet 2
DB11-1: B22.M2(N:E) ; also sheet 2
DB_SEL_DEV0: A21.D2(H:I$1) A21.K2(N:I$1) A22.D2(H:I$1) A22.K2(N:I$1) A22.R2(U:I$1) A23.D2(H:I$1) A23.K2(N:I$1) A23.R2(U:I$1) A24.D2(H:I$1) A24.K2(N:I$1) A24.R2(U:I$1) B23.D2(H:I$1) B23.K2(N:I$1) B23.R2(U:I$1) ; also sheet 4
DB_SEL_DEV1: B20.D2(F:D) B20.H2(K:D) B20.L2(N:D) B20.P2(S:D) B21.D2(F:D) B21.H2(K:D) B21.L2(N:D) B21.P2(S:D) B21.T2(V:D) B22.D2(F:D) B22.H2(K:D) B22.L2(N:D) B22.P2(S:D) B22.T2(V:D) ; also sheet 4
N$1: B22.F2(F:F) B23.F2(H:I$3)
N$6: B22.N2(N:F) B23.T2(U:I$3)
N$8: B22.K2(K:F) B23.M2(N:I$3)
N$11: A24.F2(H:I$3) B22.S2(S:F)
N$13: A21.M2(N:I$3) B20.S2(S:F)
N$14: A21.F2(H:I$3) B20.N2(N:F)
N$15: A22.T2(U:I$3) B20.K2(K:F)
N$16: A22.M2(N:I$3) B20.F2(F:F)
N$17: A22.F2(H:I$3) B21.V2(V:F)
N$18: A23.T2(U:I$3) B21.S2(S:F)
N$20: A23.M2(N:I$3) B21.N2(N:F)
N$22: A23.F2(H:I$3) B21.K2(K:F)
N$25: A24.T2(U:I$3) B21.F2(F:F)
N$26: A24.M2(N:I$3) B22.V2(V:F)
N$79: A21.N2(N:O$1) B24.E2 B25.K2(J:I$1)
N$80: A21.H2(H:O$1) B24.F2 B25.M2(L:I$1)
N$81: A22.U2(U:O$1) B24.H2 B25.P2(N:I$1)
N$82: A22.N2(N:O$1) B24.J2 B25.S2(R:I$1)
N$83: A22.H2(H:O$1) B24.K2 B25.U2(T:I$1)
N$84: A23.U2(U:O$1) A31.E2(D:I$1) B24.L2
N$85: A23.N2(N:O$1) A31.H2(F:I$1) B24.M2
N$86: A23.H2(H:O$1) A31.K2(J:I$1) B24.N2
N$87: A24.U2(U:O$1) A31.M2(L:I$1) B24.P2
N$88: A24.N2(N:O$1) A31.P2(N:I$1) B24.R2
N$89: A24.H2(H:O$1) A31.S2(R:I$1) B24.S2
N$90: A31.U2(T:I$1) B23.U2(U:O$1) B24.T2
N$91: B23.N2(N:O$1) B24.U2 B32.P2(N:I$1)
N$92: B23.H2(H:O$1) B24.V2 B32.S2(R:I$1)
Unconnected: A22.J2 A22.P2 A22.V2 A23.J2 A23.P2 A23.V2 A31.V2(T:I$2) B25.V2(T:I$2)

### Notes on the sheet
- Data Multiplexer, Data Bits
- D-BS-DM01-0-3 | D

## Power pins joined to a net without a drawn wire
-15V: A12.B2(-15V) A13.B2(-15V) A14.B2(-15V) A15.B2(-15V) A16.B2(-15V) A17.B2(-15V) A18.B2(-15V) A19.B2(-15V) A20.B2(-15V) A21.B2(-15V) A22.B2(-15V) A23.B2(-15V) A24.B2(-15V) A25.B2(-15V) A26.B2(-15V) A27.B2(-15V) A28.B2(-15V) A31.B2(-15V) A32.B2(-15V) B17.B2(-15V) B18.B2(-15V) B19.B2(-15V) B20.B2(-15V) B21.B2(-15V) B22.B2(-15V) B23.B2(-15V) B24.B2(-15V) B25.B2(-15V) B26.B2(-15V) B27.B2(-15V) B28.B2(-15V) B29.B2(-15V) B30.B2(-15V) B31.B2(-15V) B32.B2(-15V)
GND: A01.C2 A01.F2 A01.J2 A01.L2 A01.N2 A01.R2 A01.U2 A02.C2 A02.F2 A02.J2 A02.L2 A02.N2 A02.R2 A02.U2 A03.C2 A03.F2 A03.J2 A03.L2 A03.N2 A03.R2 A03.U2 A04.C2 A04.F2 A04.J2 A04.L2 A04.N2 A04.R2 A04.U2 A05.C2 A05.F2 A05.J2 A05.L2 A05.N2 A05.R2 A05.U2 A06.C2 A06.F2 A06.J2 A06.L2 A06.N2 A06.R2 A06.U2 A07.C2 A07.F2 A07.J2 A07.L2 A07.N2 A07.R2 A07.U2 A08.C2 A08.F2 A08.J2 A08.L2 A08.N2 A08.R2 A08.U2 A09.C2 A09.F2 A09.J2 A09.L2 A09.N2 A09.R2 A09.U2 A10.C2 A10.F2 A10.J2 A10.L2 A10.N2 A10.R2 A10.U2 A11.C2 A11.F2 A11.J2 A11.L2 A11.N2 A11.R2 A11.U2 A12.C2(GND) A13.C2(GND) A14.C2(GND) A15.C2(GND) A16.C2(GND) A17.C2(GND) A18.C2(GND) A19.C2(GND) A20.C2(GND) A21.C2(GND) A22.C2(GND) A23.C2(GND) A24.C2(GND) A25.C2(GND) A26.C2(GND) A27.C2(GND) A28.C2(GND) A29.C2 A29.F2 A29.J2 A29.L2 A29.N2 A29.R2 A29.U2 A30.C2 A30.F2 A30.J2 A30.L2 A30.N2 A30.R2 A30.U2 A31.C2(GND) A32.C2(GND) B01.C2 B01.F2 B01.J2 B01.L2 B01.N2 B01.R2 B01.U2 B02.C2 B02.F2 B02.J2 B02.L2 B02.N2 B02.R2 B02.U2 B03.C2 B03.F2 B03.J2 B03.L2 B03.N2 B03.R2 B03.U2 B04.C2 B04.F2 B04.J2 B04.L2 B04.N2 B04.R2 B04.U2 B05.C2 B05.F2 B05.J2 B05.L2 B05.N2 B05.R2 B05.U2 B06.C2 B06.F2 B06.J2 B06.L2 B06.N2 B06.R2 B06.U2 B07.C2 B07.F2 B07.J2 B07.L2 B07.N2 B07.R2 B07.U2 B08.C2 B08.F2 B08.J2 B08.L2 B08.N2 B08.R2 B08.U2 B09.C2 B09.F2 B09.J2 B09.L2 B09.N2 B09.R2 B09.U2 B10.C2 B10.F2 B10.J2 B10.L2 B10.N2 B10.R2 B10.U2 B11.C2 B11.F2 B11.J2 B11.L2 B11.N2 B11.R2 B11.U2 B12.C2 B12.F2 B12.J2 B12.L2 B12.N2 B12.R2 B12.U2 B13.C2 B13.F2 B13.J2 B13.L2 B13.N2 B13.R2 B13.U2 B14.C2 B14.F2 B14.J2 B14.L2 B14.N2 B14.R2 B14.U2 B15.C2 B15.F2 B15.J2 B15.L2 B15.N2 B15.R2 B15.U2 B16.C2 B16.F2 B16.J2 B16.L2 B16.N2 B16.R2 B16.U2 B17.C2(GND) B18.C2(GND) B19.C2(GND) B20.C2(GND) B21.C2(GND) B22.C2(GND) B23.C2(GND) B24.C2(GND) B25.C2(GND) B26.C2(GND) B27.C2(GND) B28.C2(GND) B29.C2(GND) B30.C2(GND) B31.C2(GND) B32.C2(GND)
VCC: A12.A2(VCC) A13.A2(VCC) A14.A2(VCC) A15.A2(VCC) A16.A2(VCC) A17.A2(VCC) A18.A2(VCC) A19.A2(VCC) A20.A2(VCC) A21.A2(VCC) A22.A2(VCC) A23.A2(VCC) A24.A2(VCC) A25.A2(VCC) A26.A2(VCC) A27.A2(VCC) A28.A2(VCC) A31.A2(VCC) A32.A2(VCC) B17.A2(VCC) B18.A2(VCC) B19.A2(VCC) B20.A2(VCC) B21.A2(VCC) B22.A2(VCC) B23.A2(VCC) B24.A2(VCC) B25.A2(VCC) B26.A2(VCC) B27.A2(VCC) B28.A2(VCC) B29.A2(VCC) B30.A2(VCC) B31.A2(VCC) B32.A2(VCC)

## Library data of the parts
A01-A09 A10 A11 A29 A30 B01-B09 B10-B16 = dec-m:W021: One-sided 9 pin connector/cable with grounds (Negibus).
A12-A14 A25 A31 B25 B32 = dec-m:R107: 7 Inverters
A15 B24 = dec-m:W005: 15 Clamped Loads
A16-A24 A26 A27 B23 B30 = dec-m:R111: Diode Gate
A28 B27 B31 = dec-m:R202: Dual Flip-Flop
A32 = dec-m:R181: Carry Chain/Priority Encoder
B17-B22 = dec-m:R002: 5 Diode Networks
B26 = dec-m:R603: Triple Pulse Amplifier
B28 = dec-m:W640: Pulse Amplifiers
B29 = dec-m:R302: Dual Delay (One Shot)
PDP-8 PDP-8I PDP-12 = jumper:JP1Q: JUMPER

## Net classes
0 default: width 0.254 mm
1 Supply: width 0.762 mm